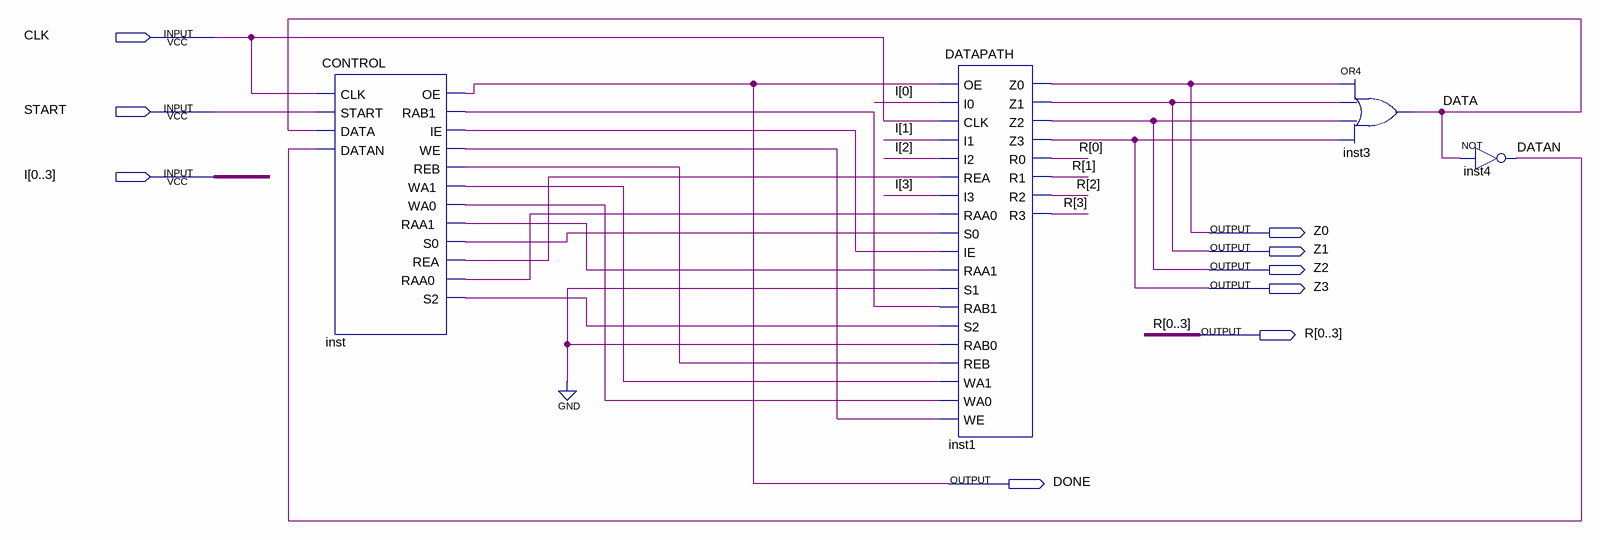
[diagram p0: schematic sheet]
// Quartus schematic FINAL.bdf as structural Verilog: 4 symbols, 9 pins
module FINAL (
  input  CLK,
  input  START,
  input  [0:3] I,
  output Z0,
  output Z1,
  output Z2,
  output Z3,
  output [0:3] R,
  output DONE
);

  wire DATA, DATAN, inst_ie, inst_raa0, inst_raa1, inst_rab1, inst_rea, inst_reb, inst_s0, inst_s2, inst_wa0,
       inst_wa1, inst_we;

  CONTROL inst (
    .CLK(CLK), .START(START), .DATA(DATA), .DATAN(DATAN), .OE(DONE), .RAB1(inst_rab1), .IE(inst_ie),
    .WE(inst_we), .REB(inst_reb), .WA1(inst_wa1), .WA0(inst_wa0), .RAA1(inst_raa1), .S0(inst_s0),
    .REA(inst_rea), .RAA0(inst_raa0), .S2(inst_s2));
  DATAPATH inst1 (
    .OE(DONE), .I0(I[0]), .CLK(CLK), .I1(I[1]), .I2(I[2]), .REA(inst_rea), .I3(I[3]), .RAA0(inst_raa0),
    .S0(inst_s0), .IE(inst_ie), .RAA1(inst_raa1), .S1(1'b0), .RAB1(inst_rab1), .S2(inst_s2), .RAB0(1'b0),
    .REB(inst_reb), .WA1(inst_wa1), .WA0(inst_wa0), .WE(inst_we), .Z0(Z0), .Z1(Z1), .Z2(Z2), .Z3(Z3),
    .R0(R[0]), .R1(R[1]), .R2(R[2]), .R3(R[3]));
  or inst3 (DATA, Z0, Z1, Z2, Z3);
  not inst4 (DATAN, DATA);
endmodule
